# Altium schematic sheet Index.SchDoc
size 420 x 297 mm; SheetNumber: 1; SheetTotal: 4
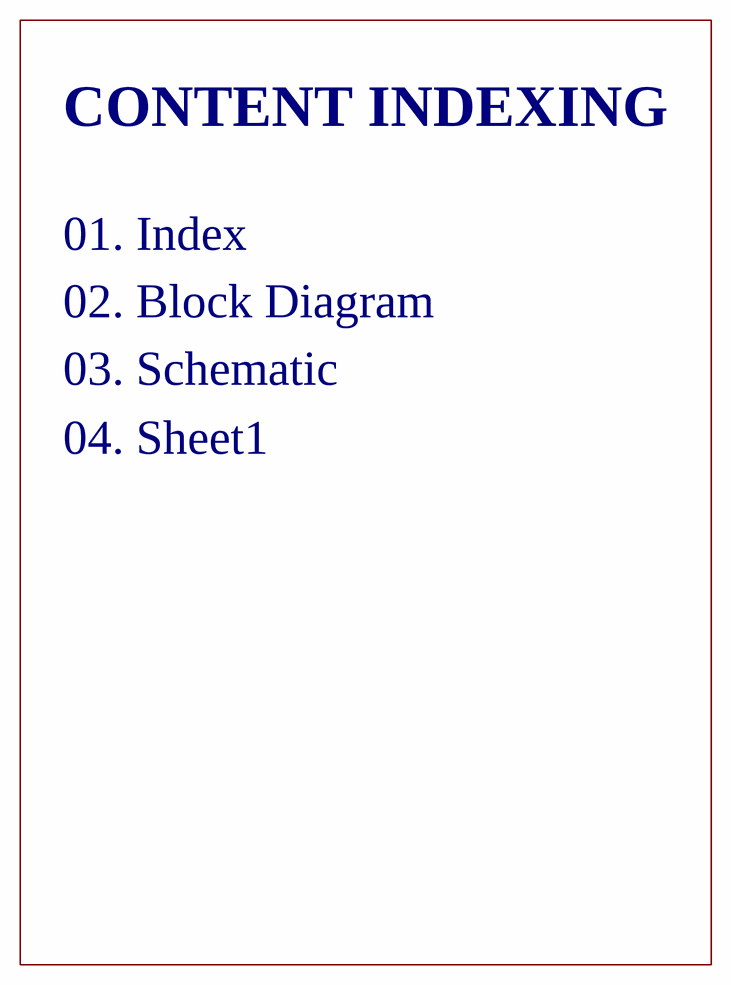
[diagram p0: Index.SchDoc]

## Notes on the sheet
- CONTENT INDEXING
- 01. Index
- 02. Block Diagram
- 03. Schematic
- 04. Sheet1
- Drawing
- Phạm Nhật Tiến
- 15/03/2025
- Text
- GROUP 19
- Checked
- 16/03/2025
- Size
- A3
- Date: Thursday, March 20/2025
- Sheet: